# Altium schematic sheet main_sch.SchDoc
size A4
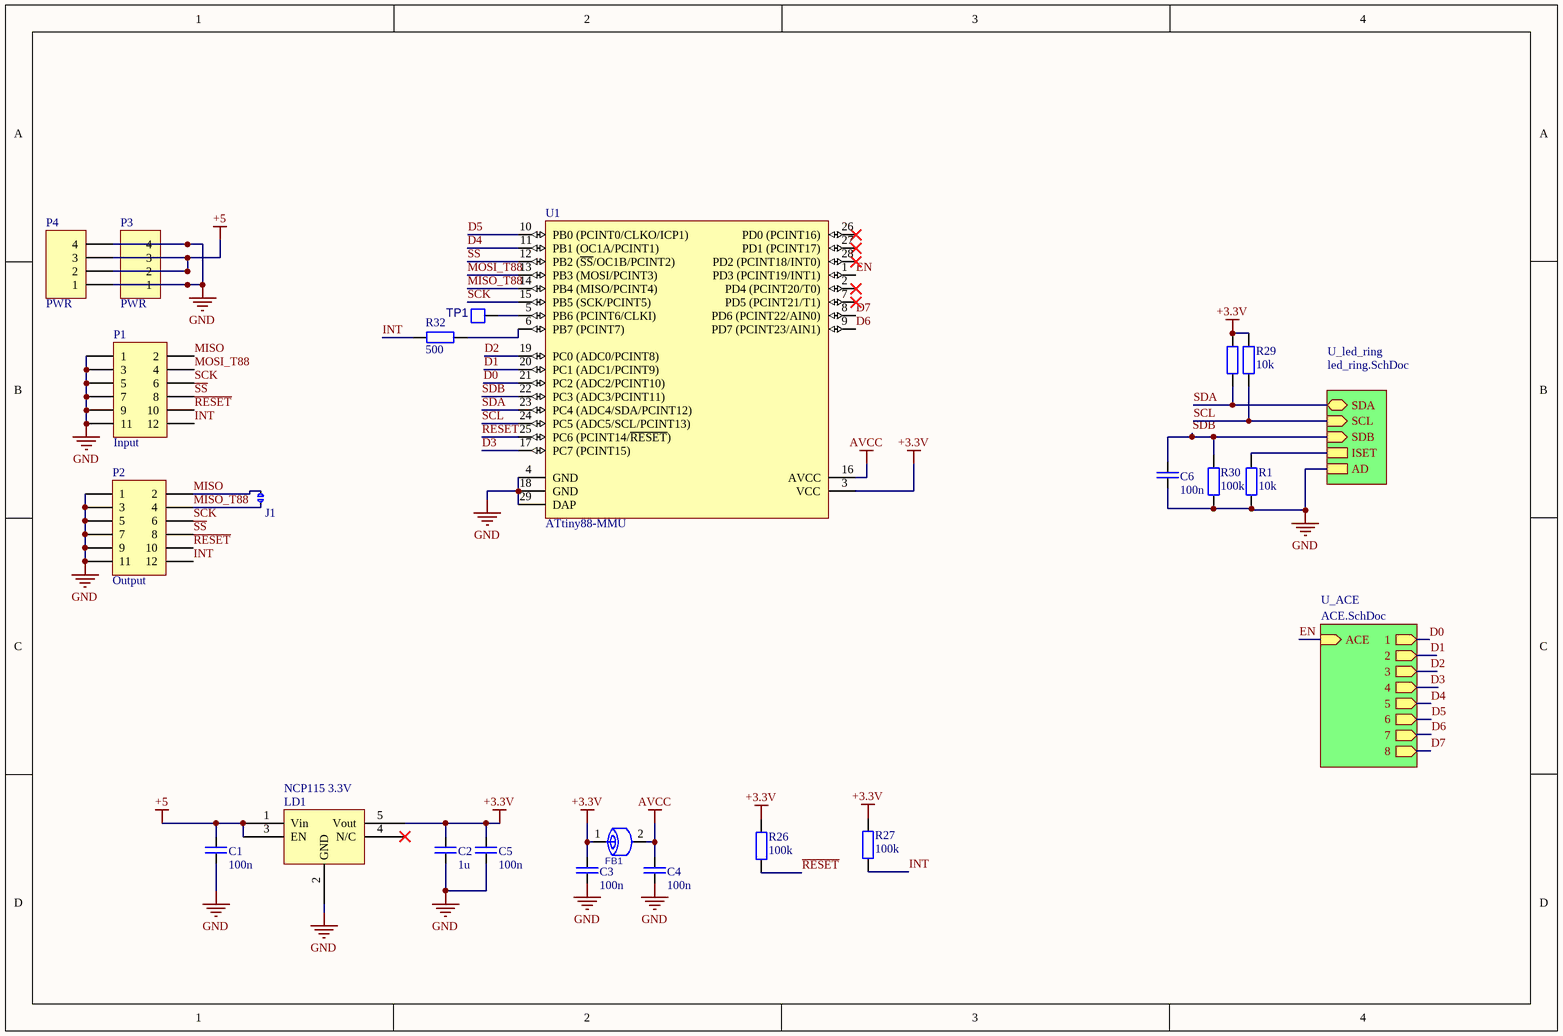
[diagram p0: main_sch.SchDoc]

## Parts
C1  100n  [R1005_0402i_L]
C2  1u  [C1608_0603I_L]
C3  100n  [R1005_0402i_L]
C4  100n  [R1005_0402i_L]
C5  100n  [R1005_0402i_L]
C6  100n  [R1005_0402i_L]
FB1  FERITTE BEAD  [R1608_0603I_L]  (value not drawn)
J1  Terminator  [solderJumper]  (value not drawn)
LD1  NCP115 3.3V  [TSOP95P280X110-6L]
P1  Input  [1.27mm SMD conn]
P2  Output  [1.27mm SMD conn]
P3  PWR  [HDR1X4]
P4  PWR  [HDR1X4]
R1  10k  [R1005_0402i_L]
R26  100k  [R1005_0402i_L]
R27  100k  [R1005_0402i_L]
R28  10k  [R1005_0402i_L]  (value not drawn)
R29  10k  [R1005_0402i_L]
R30  100k  [R1005_0402i_L]
R32  500  [R1005_0402i_L]
TP1  PAD  [PAD]  (value not drawn)
U1  ATtiny88-MMU  [28M1_N]

## Sub-sheets
U_ACE = ACE.SchDoc: 1 (out), 2 (out), 3 (out), 4 (out), 5 (out), 6 (out), 7 (out), 8 (out), ACE (in)
U_led_ring = led_ring.SchDoc: SDA (bidir), SCL (in), SDB (in), ISET, AD

## Nets
+3.3V: C2.1 C3.1 C5.1 FB1.1 LD1.5(Vout) R26.1 R27.1 R28.1 R29.1 U1.3(VCC)
+5: C1.1 LD1.1(Vin) LD1.3(EN) P3.2 P3.3 P4.2 P4.3
AVCC: C4.1 FB1.2 U1.16(AVCC)
GND: C1.2 C2.2 C3.2 C4.2 C5.2 C6.2 LD1.2(GND) P1.1 P1.3 P1.5 P1.7 P1.9 P1.11 P2.1 P2.3 P2.5 P2.7 P2.9 P2.11 P3.1 P3.4 P4.1 P4.4 R1.2 R30.2 U1.4(GND) U1.18(GND) U1.29(DAP) ; sheet U_led_ring/AD
D0: U1.21(PC2_(ADC2/PCINT10)) ; sheet U_ACE/1
D1: U1.20(PC1_(ADC1/PCINT9)) ; sheet U_ACE/2
D2: U1.19(PC0_(ADC0/PCINT8)) ; sheet U_ACE/3
D3: U1.17(PC7_(PCINT15)) ; sheet U_ACE/4
D4: U1.11(PB1_(OC1A/PCINT1)) ; sheet U_ACE/5
D5: U1.10(PB0_(PCINT0/CLKO/ICP1)) ; sheet U_ACE/6
D6: U1.9(PD7_(PCINT23/AIN1)) ; sheet U_ACE/7
D7: U1.8(PD6_(PCINT22/AIN0)) ; sheet U_ACE/8
EN: U1.1(PD3_(PCINT19/INT1)) ; sheet U_ACE/ACE
INT: P1.12 P2.12 R27.2 R32.1
MISO: J1.2 P1.2 P2.2
MISO_T88: J1.1 P2.4 U1.14(PB4_(MISO/PCINT4))
MOSI_T88: P1.4 U1.13(PB3_(MOSI/PCINT3))
~{RESET}: P1.10 P2.10 R26.2 U1.25(PC6_(PCINT14/~{RESET}))
~{SS}: P1.8 P2.8 U1.12(PB2_(~{SS}/OC1B/PCINT2))
SCK: P1.6 P2.6 U1.15(PB5_(SCK/PCINT5))
SCL: R29.2 U1.24(PC5_(ADC5/SCL/PCINT13)) ; sheet U_led_ring/SCL
SDA: R28.2 U1.23(PC4_(ADC4/SDA/PCINT12)) ; sheet U_led_ring/SDA
SDB: C6.1 R30.1 U1.22(PC3_(ADC3/PCINT11)) ; sheet U_led_ring/SDB
NetR1_1: R1.1 ; sheet U_led_ring/ISET
NetR32_2: R32.2 U1.6(PB7_(PCINT7))
NetTP1_1: TP1.1 U1.5(PB6_(PCINT6/CLKI))

Not connected (* = marked no-connect by the designer): LD1 4(N/C)*; U1 2(PD4_(PCINT20/T0))* 7(PD5_(PCINT21/T1))* 26(PD0_(PCINT16))* 27(PD1_(PCINT17))* 28(PD2_(PCINT18/INT0))*

## Library data of the parts
C1-C6 = C: Capacitor
J1 = JMP_mini
P1 P2 = Header 6X2: Header, 6-Pin, Dual row; LatestRevisionDate: 17-Jul-2002; LatestRevisionNote: Re-released for DXP Platform.; Publisher: Altium Limited
P3 P4 = Header 4: Header, 4-Pin; LatestRevisionDate: 17-Jul-2002; LatestRevisionNote: Re-released for DXP Platform.; Publisher: Altium Limited
R1 R26-R30 R32 = R
U1 = ATtiny88-MMU: 8-bit AVR Microcontroller, 1.8-5.5V, 8KB Flash, 64 Bytes EEPROM, 512 Bytes SRAM, 28-pin MLF, Industrial Grade (-40°C to 85°C), Pb-Free; Published: 1-Apr-2010; DatasheetVersion: revC, Mar-2009; PackageVersion: revB, Nov-2008; PackageReference: 28M1; Publisher: Altium Limited; PackageDescription: 28-pad, 4x4x1.0mm Body, Pitch 0.45mm, 2.4x2.4mm Exposed Pad, Plastic Very Thin QFN Package (VQFN); Supplier 1: Digi-Key; Supplier Part Number 1: ATTINY88-MMU-ND; Supplier 2: Mouser; Supplier Part Number 2: 556-ATTINY88-MMU; ComponentLink1Description: Manufacturer Link; ComponentLink1URL: http://www.atmel.com/products/avr/default.asp?; ComponentLink2Description: ATtiny48/88 Datasheet; ComponentLink2URL: http://www.atmel.com/dyn/resources/prod_documents/doc8008.pdf; ComponentLink3Description: ATtiny48/88 Summary; ComponentLink3URL: http://www.atmel.com/dyn/resources/prod_documents/8008S.pdf; ComponentLink4Description: Atmel.com Home; ComponentLink4URL: http://www.atmel.com